# Altium project RasPiHAT-MOSFET.PrjPcb
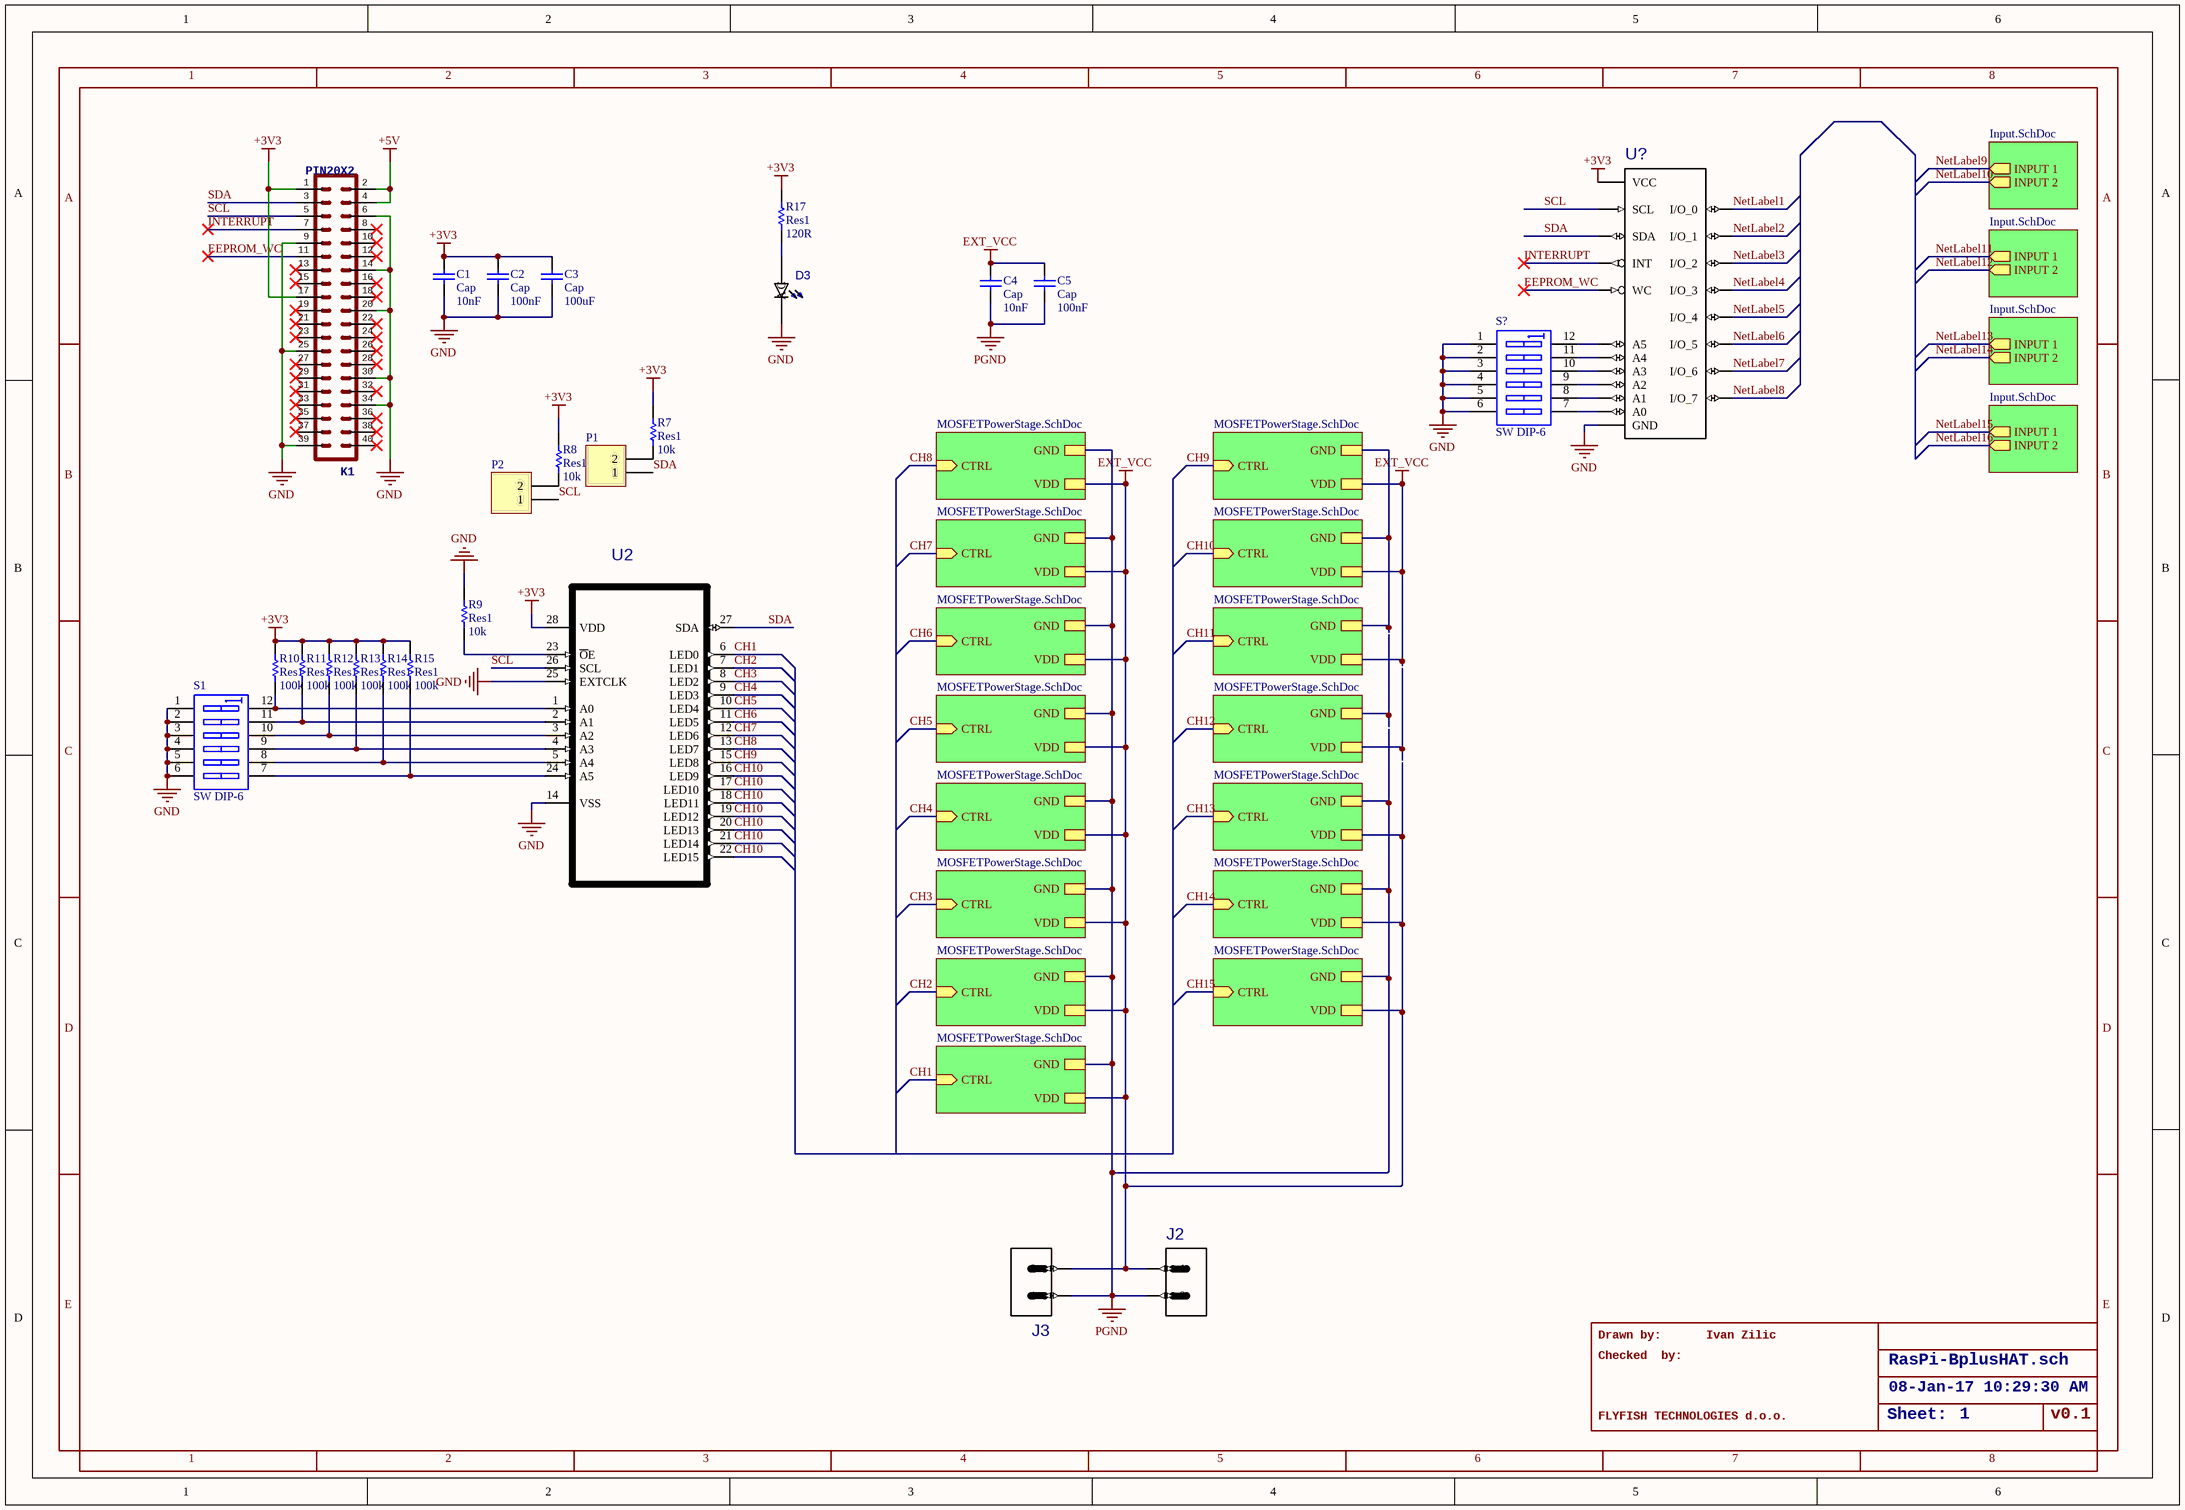
[diagram p0: RasPiHAT-MOSFET.SchDoc]
2 sheets, 175 parts. Net scope: hierarchical (ports join the sheet entries above them; power ports are global).
Board file: RasPiHAT-MOSFET.PcbDoc
Sheets:
  RasPiHAT-MOSFET.SchDoc
    RM1 = MOSFETPowerStage.SchDoc
    RM2 = MOSFETPowerStage.SchDoc
    RM3 = MOSFETPowerStage.SchDoc
    RM4 = MOSFETPowerStage.SchDoc
    RM5 = MOSFETPowerStage.SchDoc
    RM6 = MOSFETPowerStage.SchDoc
    RM7 = MOSFETPowerStage.SchDoc
    RM8 = MOSFETPowerStage.SchDoc
    RM9 = MOSFETPowerStage.SchDoc
    RM10 = MOSFETPowerStage.SchDoc
    RM10 = MOSFETPowerStage.SchDoc
    RM10 = MOSFETPowerStage.SchDoc
    RM10 = MOSFETPowerStage.SchDoc
    RM10 = MOSFETPowerStage.SchDoc
    RM10 = MOSFETPowerStage.SchDoc

## Sheet RasPiHAT-MOSFET.SchDoc
size 409 x 282 mm; >DRAWING_NAME: RasPi-BplusHAT.sch; >LAST_DATE_TIME: 08-Jan-17 10:29:30 AM; >SHEET: 1; Sheet:: Sheet:

### Parts
C1  Cap  value 10nF  [6-0805_N]
C2  Cap  value 100nF  [6-0805_N]
C3  Cap  value 100uF  [6-0805_N]
C4  Cap  value 10nF  [6-0805_N]
C5  Cap  value 100nF  [6-0805_N]
D3  0805_LED  [LEDSC200X125X70-2N_598-8160-107F(Primary)]  (value not drawn)
J2  1760510000  [1760490000]  (value not drawn)
J3  1760510000  [1760490000]  (value not drawn)
K1  >NAME: K1  [HDR2X20]  (hidden comment: PIN20X2)
P1  Header 2  [HDR1X2]  (value not drawn)
P2  Header 2  [HDR1X2]  (value not drawn)
R7  Res1  value 10k  [6-0805_N]
R8  Res1  value 10k  [6-0805_N]
R9  Res1  value 10k  [6-0805_N]
R10  Res1  value 100k  [6-0805_N]
R11  Res1  value 100k  [6-0805_N]
R12  Res1  value 100k  [6-0805_N]
R13  Res1  value 100k  [6-0805_N]
R14  Res1  value 100k  [6-0805_N]
R15  Res1  value 100k  [6-0805_N]
R17  Res1  value 120R  [6-0805_N]
S1  SW DIP-6  [DIP-12/SW]
S?  SW DIP-6  [DIP-12/SW]
U2  PCA9685PW  [SOP65P640X110-28N]  (value not drawn)
U?  PCA9501  [TSSOP20]  (value not drawn)

### Sub-sheets
RM = Input.SchDoc (file not in this document): INPUT 1 (out), INPUT 2 (out)
RM = Input.SchDoc (file not in this document): INPUT 1 (out), INPUT 2 (out)
RM = Input.SchDoc (file not in this document): INPUT 1 (out), INPUT 2 (out)
RM = Input.SchDoc (file not in this document): INPUT 1 (out), INPUT 2 (out)
RM1 = MOSFETPowerStage.SchDoc: CTRL (in), VDD, GND
RM2 = MOSFETPowerStage.SchDoc: CTRL (in), VDD, GND
RM3 = MOSFETPowerStage.SchDoc: CTRL (in), VDD, GND
RM4 = MOSFETPowerStage.SchDoc: CTRL (in), VDD, GND
RM5 = MOSFETPowerStage.SchDoc: CTRL (in), VDD, GND
RM6 = MOSFETPowerStage.SchDoc: CTRL (in), VDD, GND
RM7 = MOSFETPowerStage.SchDoc: CTRL (in), VDD, GND
RM8 = MOSFETPowerStage.SchDoc: CTRL (in), VDD, GND
RM9 = MOSFETPowerStage.SchDoc: CTRL (in), VDD, GND
RM10 = MOSFETPowerStage.SchDoc: CTRL (in), VDD, GND
RM10 = MOSFETPowerStage.SchDoc: CTRL (in), VDD, GND
RM10 = MOSFETPowerStage.SchDoc: CTRL (in), VDD, GND
RM10 = MOSFETPowerStage.SchDoc: CTRL (in), VDD, GND
RM10 = MOSFETPowerStage.SchDoc: CTRL (in), VDD, GND
RM10 = MOSFETPowerStage.SchDoc: CTRL (in), VDD, GND

### Nets
+3V3: C1.2 C2.2 C3.2 K1.1 K1.17 R7.1 R8.1 R10.1 R11.1 R12.1 R13.1 R14.1 R15.1 R17.1 U2.28(VDD) U?.20(VCC)
+5V: K1.2 K1.4
EXT_VCC: C4.2 C5.2 J2.1 J3.2 ; sheet RM1/VDD, sheet RM2/VDD, sheet RM3/VDD, sheet RM4/VDD, sheet RM5/VDD, sheet RM6/VDD, sheet RM7/VDD, sheet RM8/VDD, sheet RM9/VDD, sheet RM10/VDD, sheet RM10/VDD, sheet RM10/VDD, sheet RM10/VDD, sheet RM10/VDD, sheet RM10/VDD
GND: C1.1 C2.1 C3.1 D3.C K1.6 K1.9 K1.14 K1.20 K1.25 K1.30 K1.34 K1.39 R9.1 S1.1(A1) S1.2(A2) S1.3(A3) S1.4(A4) S1.5(A5) S1.6(A6) S?.1(A1) S?.2(A2) S?.3(A3) S?.4(A4) S?.5(A5) S?.6(A6) U2.14(VSS) U2.25(EXTCLK) U?.10(GND)
PGND: C4.1 C5.1 J2.2 J3.1 ; sheet RM1/GND, sheet RM2/GND, sheet RM3/GND, sheet RM4/GND, sheet RM5/GND, sheet RM6/GND, sheet RM7/GND, sheet RM8/GND, sheet RM9/GND, sheet RM10/GND, sheet RM10/GND, sheet RM10/GND, sheet RM10/GND, sheet RM10/GND, sheet RM10/GND
CH1: U2.6(LED0) ; sheet RM8/CTRL
CH2: U2.7(LED1) ; sheet RM7/CTRL
CH3: U2.8(LED2) ; sheet RM6/CTRL
CH4: U2.9(LED3) ; sheet RM5/CTRL
CH5: U2.10(LED4) ; sheet RM4/CTRL
CH6: U2.11(LED5) ; sheet RM3/CTRL
CH7: U2.12(LED6) ; sheet RM2/CTRL
CH8: U2.13(LED7) ; sheet RM1/CTRL
CH9: U2.15(LED8) ; sheet RM9/CTRL
CH10: U2.16(LED9) U2.17(LED10) U2.18(LED11) U2.19(LED12) U2.20(LED13) U2.21(LED14) U2.22(LED15) ; sheet RM10/CTRL
EEPROM_WC: K1.11 U?.17(WC)
INTERRUPT: K1.7 U?.8(INT)
NetLabel1: U?.4(I/O_0)
NetLabel2: U?.5(I/O_1)
NetLabel3: U?.6(I/O_2)
NetLabel4: U?.7(I/O_3)
NetLabel5: U?.13(I/O_4)
NetLabel6: U?.14(I/O_5)
NetLabel7: U?.15(I/O_6)
NetLabel8: U?.16(I/O_7)
NetLabel9: sheet RM/INPUT 1
NetLabel10: sheet RM/INPUT 2
NetLabel11: sheet RM/INPUT 1
NetLabel12: sheet RM/INPUT 2
NetLabel13: sheet RM/INPUT 1
NetLabel14: sheet RM/INPUT 2
NetLabel15: sheet RM/INPUT 1
NetLabel16: sheet RM/INPUT 2
SCL: K1.5 P2.1 U2.26(SCL) U?.18(SCL)
SDA: K1.3 P1.1 U2.27(SDA) U?.19(SDA)
NetD3_A: D3.A R17.2
NetP1_2: P1.2 R7.2
NetP2_2: P2.2 R8.2
NetR9_2: R9.2 U2.23(~{O}E)
NetR10_2: R10.2 S1.12(B1) U2.1(A0)
NetR11_2: R11.2 S1.11(B2) U2.2(A1)
NetR12_2: R12.2 S1.10(B3) U2.3(A2)
NetR13_2: R13.2 S1.9(B4) U2.4(A3)
NetR14_2: R14.2 S1.8(B5) U2.5(A4)
NetR15_2: R15.2 S1.7(B6) U2.24(A5)
NetS?_7: S?.7(B6) U?.1(A0)
NetS?_8: S?.8(B5) U?.2(A1)
NetS?_9: S?.9(B4) U?.3(A2)
NetS?_10: S?.10(B3) U?.12(A3)
NetS?_11: S?.11(B2) U?.11(A4)
NetS?_12: S?.12(B1) U?.9(A5)

Not connected (* = marked no-connect by the designer): K1 8* 10* 12* 13* 15* 16* 18* 19* 21* 22* 23* 24* 26* 27* 28* 29* 31* 32* 33* 35* 36* 37* 38* 40*

### Notes on the sheet
- Drawn by:
- Checked  by:
- Ivan Zilic
- FLYFISH TECHNOLOGIES d.o.o.
- v0.1
- 1
- 2
- 3
- 4
- 5
- 6
- 7
- 8
- A
- B
- C
- D
- E

### Library data of the parts
C1-C5 = Cap: Capacitor; Published: 8-Jun-2000; LatestRevisionDate: 17-Jul-2002; LatestRevisionNote: Re-released for DXP Platform.; PackageReference: RAD-0.3; Publisher: Altium Limited; PackageDescription: Radial Cap, Thru-Hole; 2 Leads; 0.3 in Pin Spacing
D3 = 598-8160-107F: LED, SMD; 0805; Yellow-Green; Water Clear Lens; 40mcd; 570/575nm; MF: Dialight; Package: 0805 Dialight; MP: 598-8160-107F; Price: 0.09 USD; Availability: Good; Value: *
J2 J3 = 1760510000: Conn Terminal Block 2 POS 5.08mm Solder ST Thru-Hole 16A; MF: Weidmuller; Package: None; MP: 1760510000; Price: 0.43 USD; Availability: Good; Value: *
P1 P2 = Header 2: Header, 2-Pin; LatestRevisionDate: 17-Jul-2002; LatestRevisionNote: Re-released for DXP Platform.; Publisher: Altium Limited
R7-R15 R17 = Res1: Resistor; Published: 8-Jun-2000; LatestRevisionDate: 17-Jul-2002; LatestRevisionNote: Re-released for DXP Platform.; PackageReference: AXIAL-0.3; Publisher: Altium Limited; PackageDescription: Axial Device, Thru-Hole; 2 Leads; 0.3 in Pin Spacing
S1 S? = SW DIP-6: DIP Switch, 6 Position, SPST; Published: 24-Mar-1999; LatestRevisionDate: 17-Jul-2002; LatestRevisionNote: Re-released for DXP Platform.; PackageReference: DIP-12/SW; Publisher: Altium Limited; PackageDescription: DIP Switch; 12 Leads
U2 = PCA9685PW: SMD IC LED DRVR, LIN DIM 25MA, 16 channels, 12bit; MF: NXP Semiconductors; Price: 1.71 USD; Package: TSSOP-28 NXP Semiconductors; MP: PCA9685PW; Availability: Warning; Value: *
U? = PCA9501: MF: NXP Semiconductors; MP: PCA9501; Package: None; Availability: Unavailable; Price: None; Value: *
K1 = PIN20X2: >VALUE: PIN20X2

## Sheet MOSFETPowerStage.SchDoc
size A4
Used 15 times, as channels RM1, RM2, RM3, RM4, RM5, RM6, RM7, RM8, RM9, RM10, RM10, RM10, RM10, RM10, RM10. Parts and nets are listed once, with the designators drawn on the sheet.
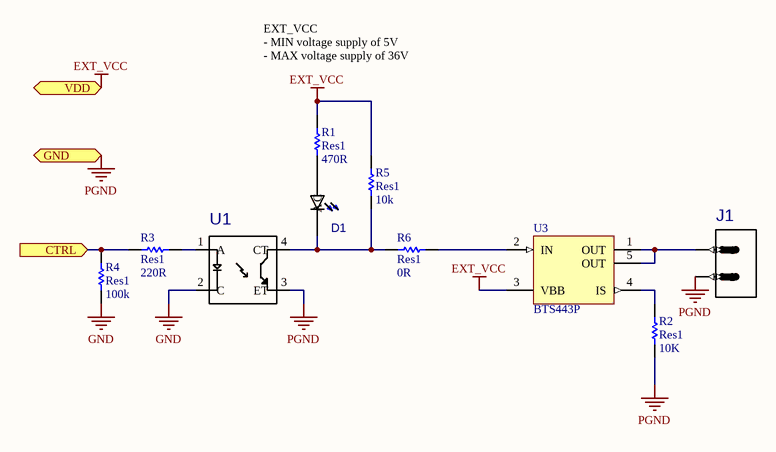
[diagram p1: MOSFETPowerStage.SchDoc]

### Parts
D1  0805_LED  [LEDSC200X125X70-2N_598-8160-107F(Primary)]  (value not drawn)
J1  1760510000  [1760490000]  (value not drawn)
R1  Res1  value 470R  [6-0805_N]
R2  Res1  value 10K  [6-0805_N]
R3  Res1  value 220R  [6-0805_N]
R4  Res1  value 100k  [6-0805_N]
R5  Res1  value 10k  [6-0805_N]
R6  Res1  value 0R  [6-0805_N]
U1  PC817X2NIP0F  [SOT254P975X400-4N]  (value not drawn)
U3  BTS443P  [INF-PG-TO252-5-11_N]

### Ports
CTRL (in), GND, VDD

### Nets
EXT_VCC: R1.1 R5.1 U3.3(VBB) ; port VDD
GND: R4.2 U1.2(C)
PGND: J1.2 R2.2 U1.3(ET) ; port GND
CTRL: R3.1 R4.1 ; port CTRL
NetD1_A: D1.A R1.2
NetD1_C: D1.C R5.2 R6.1 U1.4(CT)
NetJ1_1: J1.1 U3.1(OUT) U3.5(OUT)
NetR2_1: R2.1 U3.4(IS)
NetR3_2: R3.2 U1.1(A)
NetR6_2: R6.2 U3.2(IN)

### Channels
RM1: designators end in _RM1; ports CTRL=CH8 GND=PGND VDD=EXT_VCC
RM2: designators end in _RM2; ports CTRL=CH7 GND=PGND VDD=EXT_VCC
RM3: designators end in _RM3; ports CTRL=CH6 GND=PGND VDD=EXT_VCC
RM4: designators end in _RM4; ports CTRL=CH5 GND=PGND VDD=EXT_VCC
RM5: designators end in _RM5; ports CTRL=CH4 GND=PGND VDD=EXT_VCC
RM6: designators end in _RM6; ports CTRL=CH3 GND=PGND VDD=EXT_VCC
RM7: designators end in _RM7; ports CTRL=CH2 GND=PGND VDD=EXT_VCC
RM8: designators end in _RM8; ports CTRL=CH1 GND=PGND VDD=EXT_VCC
RM9: designators end in _RM9; ports CTRL=CH9 GND=PGND VDD=EXT_VCC
RM10: designators end in _RM10#1; ports CTRL=CH10 GND=PGND VDD=EXT_VCC
RM10: designators end in _RM10#2; ports CTRL=CH11 GND=PGND VDD=EXT_VCC
RM10: designators end in _RM10#3; ports CTRL=CH12 GND=PGND VDD=EXT_VCC
RM10: designators end in _RM10#4; ports CTRL=CH13 GND=PGND VDD=EXT_VCC
RM10: designators end in _RM10#5; ports CTRL=CH14 GND=PGND VDD=EXT_VCC
RM10: designators end in _RM10#6; ports CTRL=CH15 GND=PGND VDD=EXT_VCC

### Notes on the sheet
- EXT_VCC
  - MIN voltage supply of 5V
  - MAX voltage supply of 36V

### Library data of the parts
D1 = 598-8160-107F: as D3 on sheet RasPiHAT-MOSFET; Package: 0805 Dialight; MP: 598-8160-107F; Price: 0.09 USD; Availability: Good; Value: *
J1 = 1760510000: as J2 on sheet RasPiHAT-MOSFET; Package: None; MP: 1760510000; Price: 0.43 USD; Availability: Good; Value: *
R1-R6 = Res1: Resistor; Published: 8-Jun-2000; LatestRevisionDate: 17-Jul-2002; LatestRevisionNote: Re-released for DXP Platform.; PackageReference: AXIAL-0.3; Publisher: Altium Limited; PackageDescription: Axial Device, Thru-Hole; 2 Leads; 0.3 in Pin Spacing
U1 = PC817X2NIP0F: PC817 Series 1 Channel 80 V 5000 Vrms General Purpose Photocoupler - DIP-4; MF: Sharp Microelectronics; Availability: Good; Price: 0.30 USD; Package: PDIP-4 Sharp Microelectronics; MP: PC817X2NIP0F; Value: *
U3 = BTS443P: Smart High-Side Power Switch, 1 Channel, 7.6 A Load Current, -40 to 150 degC, PG-TO252-5-11, Reel, Green; Manufacturer: Infineon; Channels: 1; Green: TRUE; Group: Automotive Qualified; Load Current (typ): 7.6 A; Ptot (max): 42 W; Recommended Operating Voltage Max.: 36 V; Recommended Operating Voltage Min.: 5 V; RON @ 25degreesC: 16 mOhm; RON(max) @ 150degreesC: 31 mOhm; toff (max): 410 us; DatasheetVersion: Rev. 1.0; PackageVersion: Nov-10; PackageReference: PG-TO252-5-11; PackageDescription: 5-Pin Plastic (Green) Transistor Single Outline Package, 6.5 x 6.12 mm Body, 1.14 mm Pitch; Supplier 1: Mouser; Supplier Part Number 1: 726-BTS443P; Supplier 2: Newark; Supplier Part Number 2: 58M4071; Supplier 3: Farnell; Supplier Part Number 3: 1440808; Supplier 4: Farnell; Supplier Part Number 4: 1440808RL; Supplier 5: Digi-Key; Supplier Part Number 5: BTS443PINTR-ND; Supplier 6: Digi-Key; Supplier Part Number 6: BTS443PINCT-ND; Supplier 7: Digi-Key; Supplier Part Number 7: BTS443PINDKR-ND; Halogen-free: TRUE; Packing: Reel; ton (max): 410 us; Mounting Technology: Surface Mount; PartNumber: BTS443P; ComponentLink1Description: Manufacturer URL; ComponentLink1URL: http://www.infineon.com/; ComponentLink2Description: Datasheet; ComponentLink2URL: http://www.infineon.com/dgdl/BTS443P_DS_v10.pdf?folderId=db3a304314dca389011537739e37155f&fileId=db3a3043183a9555011860442f5b3616&location=en.Products.Automotive_ICs.Smart_High-_and_Low-Side_Switches.PROFET__-_Smart_High_Side_Switches.DATASHEET.BTS443P_DS_v10.pdf; ComponentLink3Description: Package Specification; ComponentLink3URL: http://www.infineon.com/dgdl/TLE7276-Data+Sheet-+v1_11.pdf?folderId=db3a304412b407950112b408e8c90004&fileId=db3a304412b407950112b436c53f66c8&sId=db3a30433db6f09f013dc0e43c0428c1

## Nets that join several sheets
EXT_VCC: RasPiHAT-MOSFET (C4.2 C5.2 J2.1 J3.2), RM1 (R1_RM1.1 R5_RM1.1 U3_RM1.3), RM2 (R1_RM2.1 R5_RM2.1 U3_RM2.3), RM3 (R1_RM3.1 R5_RM3.1 U3_RM3.3), RM4 (R1_RM4.1 R5_RM4.1 U3_RM4.3), RM5 (R1_RM5.1 R5_RM5.1 U3_RM5.3), RM6 (R1_RM6.1 R5_RM6.1 U3_RM6.3), RM7 (R1_RM7.1 R5_RM7.1 U3_RM7.3), RM8 (R1_RM8.1 R5_RM8.1 U3_RM8.3), RM9 (R1_RM9.1 R5_RM9.1 U3_RM9.3), RM10 (R1_RM10#1.1 R5_RM10#1.1 U3_RM10#1.3), RM10 (R1_RM10#2.1 R5_RM10#2.1 U3_RM10#2.3), RM10 (R1_RM10#3.1 R5_RM10#3.1 U3_RM10#3.3), RM10 (R1_RM10#4.1 R5_RM10#4.1 U3_RM10#4.3), RM10 (R1_RM10#5.1 R5_RM10#5.1 U3_RM10#5.3), RM10 (R1_RM10#6.1 R5_RM10#6.1 U3_RM10#6.3)
GND: RasPiHAT-MOSFET (28 pins), RM1 (R4_RM1.2 U1_RM1.2), RM2 (R4_RM2.2 U1_RM2.2), RM3 (R4_RM3.2 U1_RM3.2), RM4 (R4_RM4.2 U1_RM4.2), RM5 (R4_RM5.2 U1_RM5.2), RM6 (R4_RM6.2 U1_RM6.2), RM7 (R4_RM7.2 U1_RM7.2), RM8 (R4_RM8.2 U1_RM8.2), RM9 (R4_RM9.2 U1_RM9.2), RM10 (R4_RM10#1.2 U1_RM10#1.2), RM10 (R4_RM10#2.2 U1_RM10#2.2), RM10 (R4_RM10#3.2 U1_RM10#3.2), RM10 (R4_RM10#4.2 U1_RM10#4.2), RM10 (R4_RM10#5.2 U1_RM10#5.2), RM10 (R4_RM10#6.2 U1_RM10#6.2)
PGND: RasPiHAT-MOSFET (C4.1 C5.1 J2.2 J3.1), RM1 (J1_RM1.2 R2_RM1.2 U1_RM1.3), RM2 (J1_RM2.2 R2_RM2.2 U1_RM2.3), RM3 (J1_RM3.2 R2_RM3.2 U1_RM3.3), RM4 (J1_RM4.2 R2_RM4.2 U1_RM4.3), RM5 (J1_RM5.2 R2_RM5.2 U1_RM5.3), RM6 (J1_RM6.2 R2_RM6.2 U1_RM6.3), RM7 (J1_RM7.2 R2_RM7.2 U1_RM7.3), RM8 (J1_RM8.2 R2_RM8.2 U1_RM8.3), RM9 (J1_RM9.2 R2_RM9.2 U1_RM9.3), RM10 (J1_RM10#1.2 R2_RM10#1.2 U1_RM10#1.3), RM10 (J1_RM10#2.2 R2_RM10#2.2 U1_RM10#2.3), RM10 (J1_RM10#3.2 R2_RM10#3.2 U1_RM10#3.3), RM10 (J1_RM10#4.2 R2_RM10#4.2 U1_RM10#4.3), RM10 (J1_RM10#5.2 R2_RM10#5.2 U1_RM10#5.3), RM10 (J1_RM10#6.2 R2_RM10#6.2 U1_RM10#6.3)
CH1: RasPiHAT-MOSFET (U2.6), RM8 (R3_RM8.1 R4_RM8.1)
CH2: RasPiHAT-MOSFET (U2.7), RM7 (R3_RM7.1 R4_RM7.1)
CH3: RasPiHAT-MOSFET (U2.8), RM6 (R3_RM6.1 R4_RM6.1)
CH4: RasPiHAT-MOSFET (U2.9), RM5 (R3_RM5.1 R4_RM5.1)
CH5: RasPiHAT-MOSFET (U2.10), RM4 (R3_RM4.1 R4_RM4.1)
CH6: RasPiHAT-MOSFET (U2.11), RM3 (R3_RM3.1 R4_RM3.1)
CH7: RasPiHAT-MOSFET (U2.12), RM2 (R3_RM2.1 R4_RM2.1)
CH8: RasPiHAT-MOSFET (U2.13), RM1 (R3_RM1.1 R4_RM1.1)
CH9: RasPiHAT-MOSFET (U2.15), RM9 (R3_RM9.1 R4_RM9.1)
CH10: RasPiHAT-MOSFET (7 pins), RM10 (R3_RM10#1.1 R4_RM10#1.1)